# Altium project Using Signal Harnesses.PrjPCB (part 2 of 2)
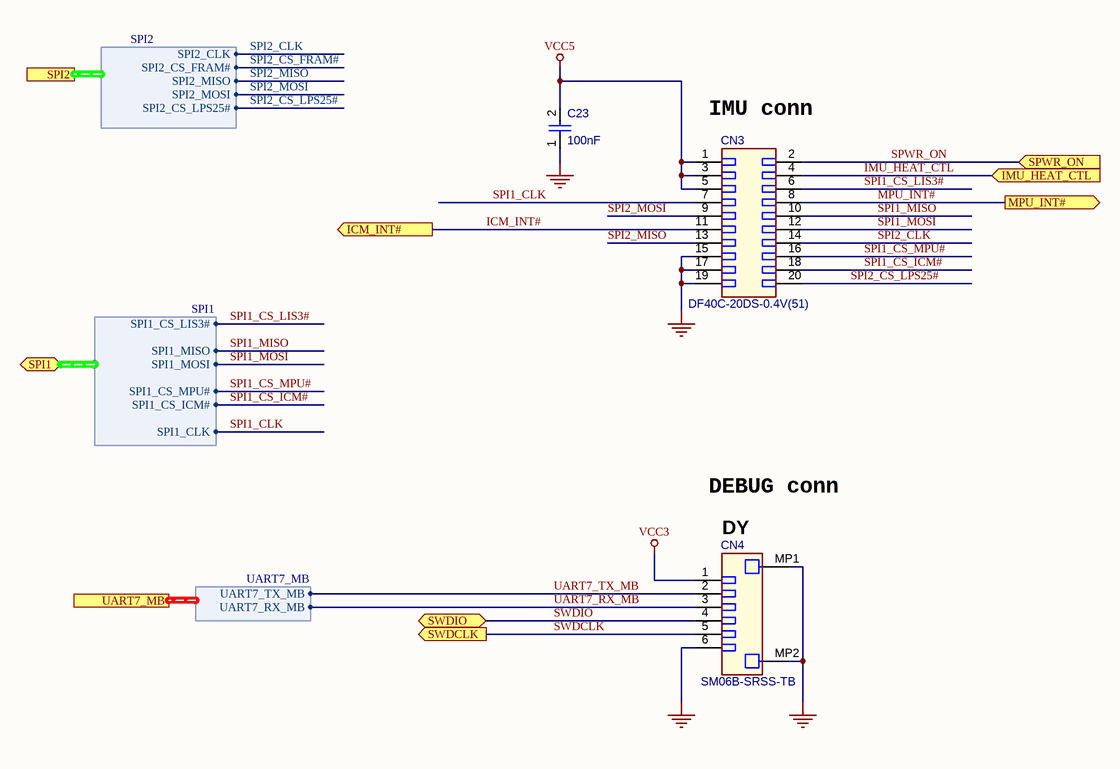
[diagram p10: 8_imu&debug_conn.SchDoc]

## Nets that join several sheets
GND: 2_mb_conn (36 pins), 3_power (11 pins), 4_cpu (34 pins), 5_spi_memory (C9.1 U3.4), 6_uart_esc_i2c (9 pins), 7_can_rc_i2c_analog (19 pins), 8_imu&debug_conn (7 pins)
VCC3: 2_mb_conn (C2.2 CN2.2 CN2.4), 3_power (C5.2 C6.1 L1.2 R2.1), 4_cpu (16 pins), 5_spi_memory (C9.2 U3.3 U3.7 U3.8), 6_uart_esc_i2c (15 pins), 7_can_rc_i2c_analog (8 pins), 8_imu&debug_conn (CN4.1)
VCC3A: 3_power (C8.2 U2.1), 4_cpu (C37.1 C38.2 R20.1 U12.22), 7_can_rc_i2c_analog (C17.2 C21.2 U8.6 U10.6)
VCC5: 2_mb_conn (5 pins), 3_power (9 pins), 4_cpu (R21.2 R23.2), 7_can_rc_i2c_analog (5 pins), 8_imu&debug_conn (C23.2 CN3.1 CN3.3 CN3.5)
-LED_B: 2_mb_conn (CN1.23), 4_cpu (U12.89)
-LED_G: 2_mb_conn (CN1.21), 4_cpu (U12.36)
-LED_R: 2_mb_conn (CN1.19), 4_cpu (U12.48)
BAT_CURRENT: 4_cpu (U12.26), 7_can_rc_i2c_analog (R16.2 U10.1 U10.4)
BAT_CURRENT_MB: 2_mb_conn (CN1.28), 7_can_rc_i2c_analog (R14.2 R16.1)
BAT_VOLTAGE: 4_cpu (U12.25), 7_can_rc_i2c_analog (R11.2 U8.1 U8.4)
BAT_VOLTAGE_MB: 2_mb_conn (CN1.30), 7_can_rc_i2c_analog (R9.2 R11.1)
BOOT: 2_mb_conn (CN2.23), 4_cpu (R29.2 U12.94)
BPWR_ON: 2_mb_conn (CN2.37), 4_cpu (U12.34)
BUZZ: 2_mb_conn (CN2.33), 4_cpu (U12.77)
CAN1_DN: 2_mb_conn (CN1.36), 7_can_rc_i2c_analog (R12.1 U9.12)
CAN1_DP: 2_mb_conn (CN1.34), 7_can_rc_i2c_analog (R12.2 U9.13)
CAN2_DN: 2_mb_conn (CN1.48), 7_can_rc_i2c_analog (R13.1 U9.9)
CAN2_DP: 2_mb_conn (CN1.46), 7_can_rc_i2c_analog (R13.2 U9.10)
ESC_M1: 4_cpu (U12.45), 6_uart_esc_i2c (U4.3)
ESC_M2: 4_cpu (U12.44), 6_uart_esc_i2c (U4.4)
ESC_M3: 4_cpu (U12.42), 6_uart_esc_i2c (U4.7)
ESC_M4: 4_cpu (U12.40), 6_uart_esc_i2c (U4.8)
ESC_M5: 4_cpu (U12.60), 6_uart_esc_i2c (U4.9)
ESC_M6: 4_cpu (U12.61), 6_uart_esc_i2c (U4.10)
EXT_SPI_CS#: 2_mb_conn (CN2.49), 4_cpu (U12.43)
EXT_SPI_MISO: 2_mb_conn (CN2.45), 4_cpu (U12.4)
EXT_SPI_MOSI: 2_mb_conn (CN2.47), 4_cpu (U12.5)
EXT_SPI_SCK: 2_mb_conn (CN2.43), 4_cpu (U12.1)
FMU_RC_INPUT: 4_cpu (U12.64), 7_can_rc_i2c_analog (U11.4)
GPIO1: 2_mb_conn (CN1.25), 4_cpu (U12.90)
GPIO2: 2_mb_conn (CN1.40), 4_cpu (U12.69)
I2C_SCL: 4_cpu (U12.95), 7_can_rc_i2c_analog (U7.2)
I2C_SCL_MB: 2_mb_conn (CN2.28), 7_can_rc_i2c_analog (R5.2 R7.2)
I2C_SDA: 4_cpu (U12.96), 7_can_rc_i2c_analog (U7.3)
I2C_SDA_MB: 2_mb_conn (CN2.30), 7_can_rc_i2c_analog (R6.1 R8.2)
ICM_INT#: 4_cpu (U12.8), 8_imu&debug_conn (CN3.11)
IMU_HEAT_CTL: 2_mb_conn (CN1.42), 4_cpu (U12.63), 8_imu&debug_conn (CN3.4)
MB_ESC_M1: 2_mb_conn (CN1.14), 6_uart_esc_i2c (RN1.6)
MB_ESC_M2: 2_mb_conn (CN1.16), 6_uart_esc_i2c (RN1.5)
MB_ESC_M3: 2_mb_conn (CN1.18), 6_uart_esc_i2c (RN2.8)
MB_ESC_M4: 2_mb_conn (CN1.20), 6_uart_esc_i2c (RN2.7)
MB_ESC_M5: 2_mb_conn (CN1.22), 6_uart_esc_i2c (RN2.6)
MB_ESC_M6: 2_mb_conn (CN1.24), 6_uart_esc_i2c (RN2.5)
MPU_INT#: 4_cpu (U12.62), 8_imu&debug_conn (CN3.8)
RC_INPUT: 2_mb_conn (CN1.11), 4_cpu (U12.35), 7_can_rc_i2c_analog (R17.1 U11.6)
RC_PWR3_ON#: 2_mb_conn (CN1.15), 4_cpu (U12.3)
RSSI_IN: 2_mb_conn (CN1.13), 4_cpu (R26.2)
RST#: 2_mb_conn (CN2.25), 4_cpu (C44.2 R19.1 U12.14)
SBUS_INV: 4_cpu (U12.7), 7_can_rc_i2c_analog (U11.1 U11.3)
SDIO_CLK: 2_mb_conn (CN1.35), 4_cpu (U12.80)
SDIO_CMD: 2_mb_conn (CN1.33), 4_cpu (U12.83)
SDIO_D0: 2_mb_conn (CN1.37), 4_cpu (U12.65)
SDIO_D1: 2_mb_conn (CN1.39), 4_cpu (U12.66)
SDIO_D2: 2_mb_conn (CN1.29), 4_cpu (U12.78)
SDIO_D3: 2_mb_conn (CN1.31), 4_cpu (U12.79)
SPI1_CLK: 4_cpu (U12.30), 8_imu&debug_conn (CN3.7)
SPI1_CS_ICM#: 4_cpu (U12.9), 8_imu&debug_conn (CN3.18)
SPI1_CS_LIS3#: 4_cpu (U12.46), 8_imu&debug_conn (CN3.6)
SPI1_CS_MPU#: 4_cpu (U12.17), 8_imu&debug_conn (CN3.16)
SPI1_MISO: 4_cpu (U12.31), 8_imu&debug_conn (CN3.10)
SPI1_MOSI: 4_cpu (U12.32), 8_imu&debug_conn (CN3.12)
SPI2_CLK: 4_cpu (U12.47), 5_spi_memory (U3.6), 8_imu&debug_conn (CN3.14)
SPI2_CS_FRAM#: 4_cpu (U12.57), 5_spi_memory (U3.1)
SPI2_CS_LPS25#: 4_cpu (U12.88), 8_imu&debug_conn (CN3.20)
SPI2_MISO: 4_cpu (U12.53), 5_spi_memory (U3.2), 8_imu&debug_conn (CN3.13)
SPI2_MOSI: 4_cpu (U12.54), 5_spi_memory (U3.5), 8_imu&debug_conn (CN3.9)
SPWR_ON: 2_mb_conn (CN2.35), 4_cpu (U12.2), 8_imu&debug_conn (CN3.2)
SS_LED: 2_mb_conn (CN1.10), 4_cpu (U12.18)
SS_SW: 2_mb_conn (CN1.8), 4_cpu (R30.1 U12.33)
SWDCLK: 2_mb_conn (CN2.19), 4_cpu (U12.76), 8_imu&debug_conn (CN4.5)
SWDIO: 2_mb_conn (CN2.21), 4_cpu (U12.72), 8_imu&debug_conn (CN4.4)
UART1_CTS: 4_cpu (U12.41), 6_uart_esc_i2c (U5.8)
UART1_RTS: 4_cpu (U12.67), 6_uart_esc_i2c (U5.7)
UART1_RX: 4_cpu (U12.93), 6_uart_esc_i2c (U5.9)
UART1_TX: 4_cpu (U12.92), 6_uart_esc_i2c (U5.10)
UART2_CTS: 4_cpu (U12.84), 6_uart_esc_i2c (U6.8)
UART2_CTS_MB: 2_mb_conn (CN2.20), 6_uart_esc_i2c (RN6.7)
UART2_RTS: 4_cpu (U12.85), 6_uart_esc_i2c (U6.7)
UART2_RTS_MB: 2_mb_conn (CN2.18), 6_uart_esc_i2c (RN6.8)
UART2_RX: 4_cpu (U12.87), 6_uart_esc_i2c (U6.9)
UART2_RX_MB: 2_mb_conn (CN2.22), 6_uart_esc_i2c (RN6.6)
UART2_TX: 4_cpu (U12.86), 6_uart_esc_i2c (U6.10)
UART2_TX_MB: 2_mb_conn (CN2.24), 6_uart_esc_i2c (RN6.5)
UART3_CTS: 4_cpu (U12.58), 6_uart_esc_i2c (U6.2)
UART3_CTS_MB: 2_mb_conn (CN2.10), 6_uart_esc_i2c (RN5.7)
UART3_RTS: 4_cpu (U12.59), 6_uart_esc_i2c (U6.1)
UART3_RTS_MB: 2_mb_conn (CN2.8), 6_uart_esc_i2c (RN5.8)
UART3_RX: 4_cpu (U12.56), 6_uart_esc_i2c (U6.3)
UART3_RX_MB: 2_mb_conn (CN2.12), 6_uart_esc_i2c (RN5.6)
UART3_TX: 4_cpu (U12.55), 6_uart_esc_i2c (U6.4)
UART3_TX_MB: 2_mb_conn (CN2.14), 6_uart_esc_i2c (RN5.5)
UART4_RX: 4_cpu (U12.24), 6_uart_esc_i2c (U5.1)
UART4_TX: 4_cpu (U12.23), 6_uart_esc_i2c (U5.2)
UART7_RX: 4_cpu (U12.38), 6_uart_esc_i2c (U4.1)
UART7_TX: 4_cpu (U12.39), 6_uart_esc_i2c (U4.2)
UART8_RX: 4_cpu (U12.97), 6_uart_esc_i2c (U5.3)
UART8_TX: 4_cpu (U12.98), 6_uart_esc_i2c (U5.4)
USB_N: 2_mb_conn (CN1.47), 4_cpu (U12.70)
USB_P: 2_mb_conn (CN1.49), 4_cpu (U12.71)
USB_VBUS: 2_mb_conn (CN1.43), 4_cpu (R24.1 U12.68)